# EAGLE design snorlax (EAGLE 7.5.0)
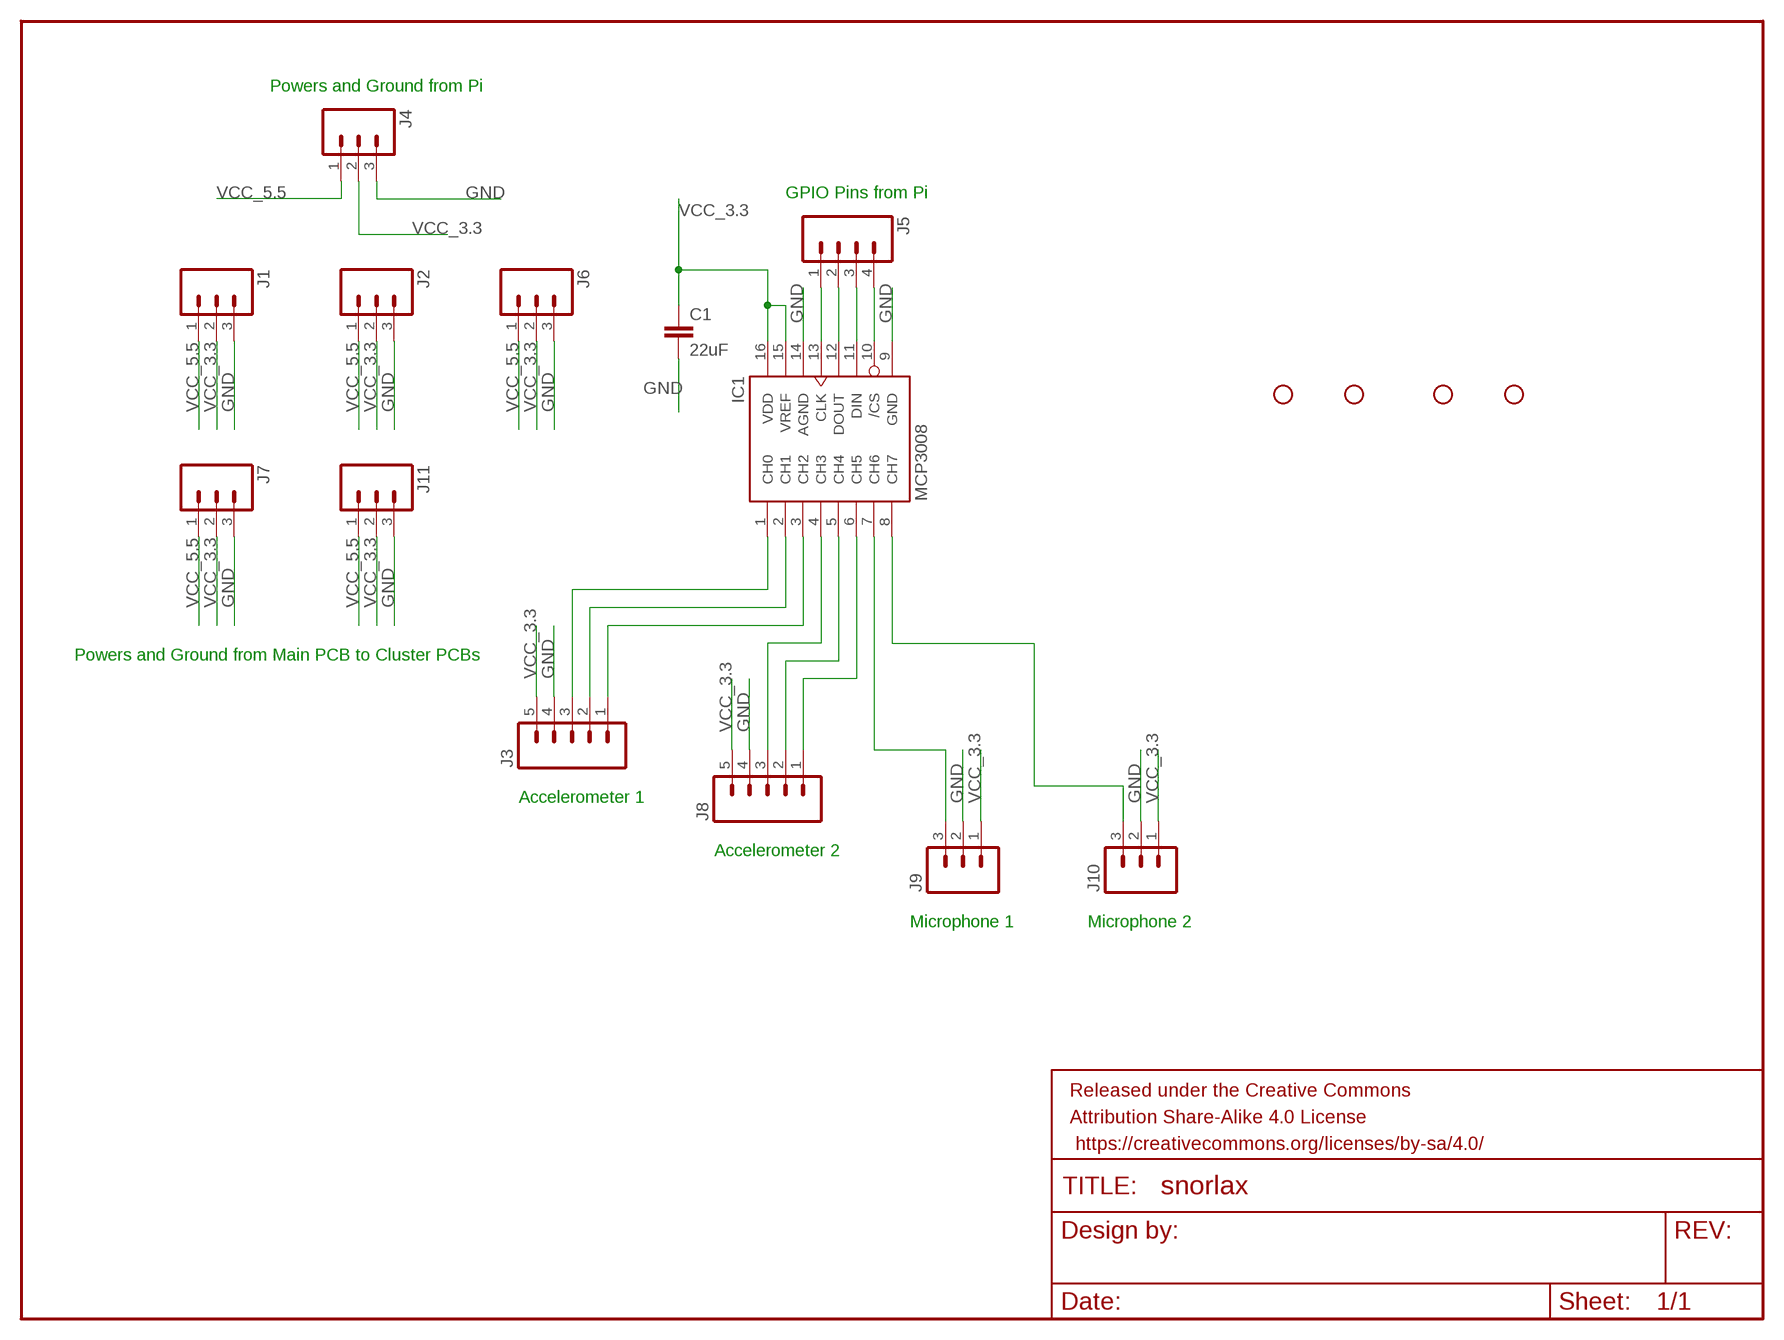
[diagram p0: schematic, sheet 1]

## Parts
C1  22uF  CAP1206  [1206]
FRAME1  FRAME-LETTER  [CREATIVE_COMMONS]
H1  STAND-OFF  [STAND-OFF]
H2  STAND-OFF  [STAND-OFF]
H3  STAND-OFF  [STAND-OFF]
H4  STAND-OFF  [STAND-OFF]
IC1  MCP3008  [DIL16]
J1  M03LOCK  [1X03_LOCK]
J2  M03LOCK  [1X03_LOCK]
J3  M05LOCK  [1X05_LOCK]
J4  M03LOCK  [1X03_LOCK]
J5  M04LOCK  [1X04_LOCK]
J6  M03LOCK  [1X03_LOCK]
J7  M03LOCK  [1X03_LOCK]
J8  M05LOCK  [1X05_LOCK]
J9  M03LOCK  [1X03_LOCK]
J10  M03LOCK  [1X03_LOCK]
J11  M03LOCK  [1X03_LOCK]

## Nets
GND: C1.2 IC1.9(GND) IC1.14(AGND) J1.3 J2.3 J3.4 J4.3 J6.3 J7.3 J8.4 J9.2 J10.2 J11.3
N$1: IC1.1(CH0) J3.3
N$2: IC1.2(CH1) J3.2
N$3: IC1.3(CH2) J3.1
N$4: IC1.4(CH3) J8.3
N$5: IC1.5(CH4) J8.2
N$6: IC1.6(CH5) J8.1
N$7: IC1.7(CH6) J9.3
N$8: IC1.8(CH7) J10.3
N$10: IC1.13(CLK) J5.1
N$11: IC1.12(DOUT) J5.2
N$12: IC1.11(DIN) J5.3
N$13: IC1.10(/CS) J5.4
VCC_3.3: C1.1 IC1.15(VREF) IC1.16(VDD) J1.2 J2.2 J3.5 J4.2 J6.2 J7.2 J8.5 J9.1 J10.1 J11.2
VCC_5.5: J1.1 J2.1 J4.1 J6.1 J7.1 J11.1

## Notes on the sheet
- Powers and Ground from Pi
- GPIO Pins from Pi
- Powers and Ground from Main PCB to Cluster PCBs
- Accelerometer 1
- Accelerometer 2
- Microphone 1 | Microphone 2

## Library data of the parts
C1 = SparkFun-Capacitors:CAP: Capacitor Standard 0603 ceramic capacitor, and 0.1" leaded capacitor.
FRAME1 = SparkFun-Aesthetics:FRAME-LETTER: Schematic Frame Standard 8.5x11 US Letter frame
H1-H4 = SparkFun-Electromechanical:STAND-OFF: #4 Stand Off This is the mechanical footprint for a #4 phillips button head screw. Use the keepout ring to avoid running the screw head into surrounding components. SKU : PRT-00447
IC1 = adafruit:MCP3008
J1 J2 J4 J6 J7 J9-J11 = SparkFun-Connectors:M03: Header 3 Standard 3-pin 0.1" header. Use with straight break away headers (SKU : PRT-00116), right angle break away headers (PRT-00553), swiss pins (PRT-00743), machine pins (PRT-00117), and female headers (PRT-00115). Molex polarized connector foot print use with SKU : PRT-08232 with associated crimp pins and housings.
J3 J8 = SparkFun-Connectors:M05: Header 5 Standard 5-pin 0.1" header. Use with straight break away headers (SKU : PRT-00116), right angle break away headers (PRT-00553), swiss pins (PRT-00743), machine pins (PRT-00117), and female headers (PRT-00115). Molex polarized connector foot print use with SKU : PRT-08230 with associated crimp pins and housings.
J5 = SparkFun-Connectors:M04: Header 4 Standard 4-pin 0.1" header. Use with straight break away headers (SKU : PRT-00116), right angle break away headers (PRT-00553), swiss pins (PRT-00743), machine pins (PRT-00117), and female headers (PRT-00115). Molex polarized connector foot print use with SKU : PRT-08231 with associated crimp pins and housings. 1MM SMD Version SKU: PRT-10208; PROD_ID: CONN-09696

## Board
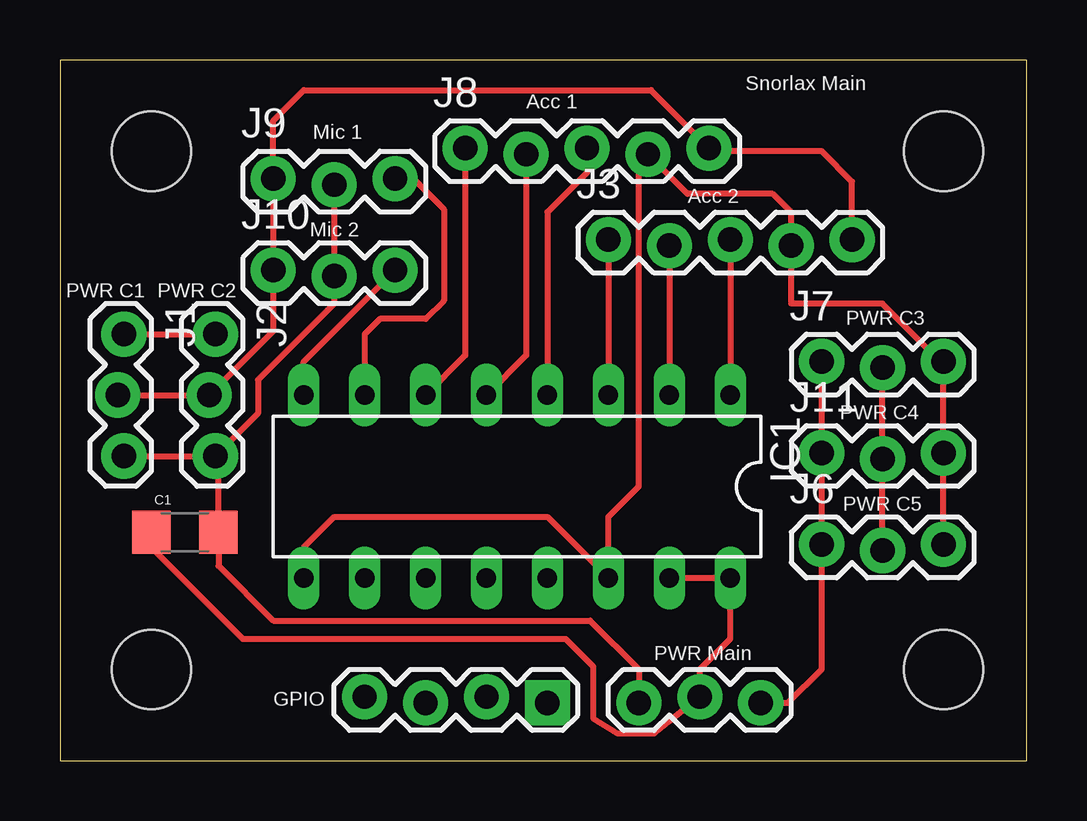
[diagram p1: board, top side]
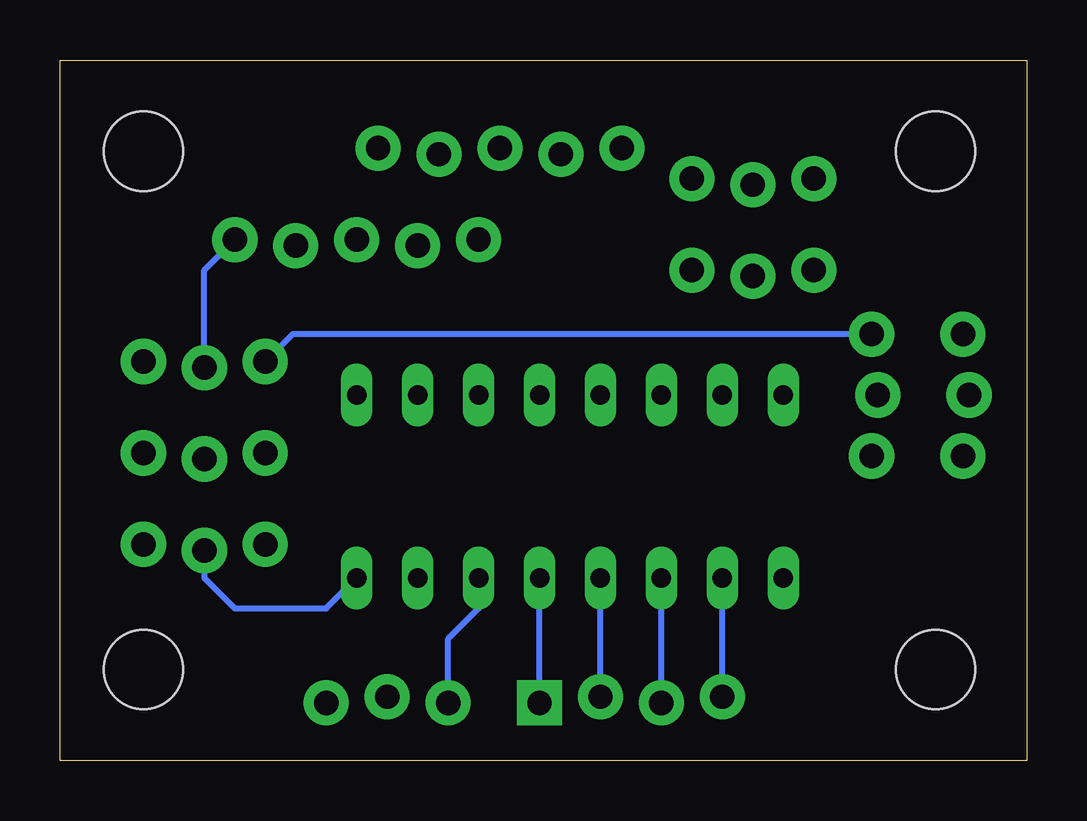
[diagram p2: board, bottom side, seen from below]

Size 40.31 x 29.2 mm. Coordinates in mm from the lower left corner, seen from the top.
Outline: 0,0 40.31,0 40.31,29.2 0,29.2 0,0
Copper layers (1*16): Top 0.035mm / dielectric 1.5mm / Bottom 0.035mm
Design rules "default": minimum track width 10mil, minimum drill 24mil, track to track 8mil, track to pad 8mil, pad to pad 8mil, via to via 8mil, smd to smd 8mil, copper to edge 40mil, drill to drill 8mil, minimum pad ring 10mil, minimum via ring 8mil, stop-mask expansion 4mil, vias tented up to drill 0mil, thermal gap 10mil

### Footprints (pad centres in the part's own frame; a part is rotated, then mirrored left to right if it is on the bottom)
1206 = smd 1.6 x 1.8: 1 -1.4,0; 2 1.4,0
STAND-OFF = hole 3.302: 0,0
DIL16 = drill 0.813 long: 1 -8.89,-3.81; 2 -6.35,-3.81; 3 -3.81,-3.81; 4 -1.27,-3.81; 5 1.27,-3.81; 6 3.81,-3.81; 7 6.35,-3.81; 8 8.89,-3.81; 9 8.89,3.81; 10 6.35,3.81; 11 3.81,3.81; 12 1.27,3.81; 13 -1.27,3.81; 14 -3.81,3.81; 15 -6.35,3.81; 16 -8.89,3.81
1X03_LOCK = drill 1.016 pad 1.88: 1 0,0.127; 2 2.54,-0.127; 3 5.08,0.127
1X05_LOCK = drill 1.016 pad 1.88: 1 0,0.127; 2 2.54,-0.127; 3 5.08,0.127; 4 7.62,-0.127; 5 10.16,0.127
1X04_LOCK = drill 1.016 pad 1.88 square: 1 0,0.127 | drill 1.016 pad 1.88: 2 2.54,-0.127; 3 5.08,0.127; 4 7.62,-0.127

### Placement (x,y rotation side)
C1  5.21,9.53 0 top
FRAME1  -101.6,1.27 0 top  (outside the outline)
H1  3.81,3.81 0 top
H2  3.81,25.4 0 top
H3  36.83,25.4 0 top
H4  36.83,3.81 0 top
IC1  19.05,11.43 180 top
J1  2.54,17.78 270 top
J2  6.35,17.78 270 top
J3  22.86,21.59 0 top
J4  29.21,2.54 180 top
J5  20.32,2.54 180 top
J6  31.75,8.89 0 top
J7  31.75,16.51 0 top
J8  16.89,25.4 0 top
J9  8.89,24.13 0 top
J10  8.89,20.32 0 top
J11  31.75,12.7 0 top

### Tracks (layer width: path | path; a pad name or v marks a point on that pad's centre or on a via)
GND
  Top 0.254: J6.3 J11.3 J7.3 36.7,16.64 34.29,19.05 30.48,19.05 J3.4 30.48,22.86 29.72,23.62 26.16,23.62 J8.4 24.13,24.89 24.13,11.43 22.86,10.16 IC1.14 20.32,10.16 11.43,10.16 10.16,8.89 IC1.9 | J1.3 J2.3 | 6.35,12.57 J2.3 | J9.2 J10.2 11.43,19.05 8.26,15.88 8.26,14.48 J2.3 | J4.3 24.13,3.81 22.1,5.84 8.89,5.84 6.61,8.12 C1.2 6.61,12.57 J2.3
  Bottom 0.254: J4.3 24.13,5.08 22.86,6.35 IC1.14
N$1
  Top 0.254: J3.3 IC1.1
N$2
  Top 0.254: J3.2 IC1.2
N$3
  Top 0.254: J3.1 IC1.3
N$4
  Top 0.254: J8.3 21.97,24.51 20.32,22.86 IC1.4
N$5
  Top 0.254: J8.2 19.43,16.89 IC1.5
N$6
  Top 0.254: J8.1 16.89,16.89 IC1.6
N$7
  Top 0.254: J9.3 14.73,24.26 16,22.99 16,19.18 15.24,18.41 13.34,18.41 12.7,17.78 IC1.7
N$8
  Top 0.254: IC1.8 10.16,16.64 J10.3
N$10
  Bottom 0.254: J5.1 IC1.13
N$11
  Bottom 0.254: J5.2 IC1.12
N$12
  Bottom 0.254: J5.3 IC1.11
N$13
  Bottom 0.254: J5.4 IC1.10
VCC_3.3
  Top 0.254: J6.2 J11.2 J7.2 | J1.2 J2.2 8.89,17.91 J10.1 J9.1 8.89,26.67 10.16,27.94 24.64,27.94 J8.5 27.18,25.4 31.75,25.4 33.02,24.13 J3.5 | IC1.15 IC1.16 27.94,5.08 26.67,3.81 J4.2 24.77,1.14 23.24,1.14 22.23,1.78 22.23,3.94 21.08,5.08 7.62,5.08 3.81,8.89 C1.1
  Bottom 0.254: J6.2 34.29,7.62 33.02,6.35 29.21,6.35 IC1.16 | J7.2 34.29,20.45 J3.5
VCC_5.5
  Top 0.254: J4.1 30.35,2.41 31.75,3.81 J6.1 J11.1 J7.1 | J1.1 J2.1
  Bottom 0.254: J2.1 30.61,17.78 J7.1

### Text on the board
tPlace: Snorlax Main | Acc 1 | Mic 1 | Acc 2 | Mic 2 | PWR C1 | PWR C2 | PWR C3 | PWR C4 | PWR C5 | PWR Main | GPIO